# Altium project TL3572-EVM-A1.1-000-SCH-202609041404.PrjPcb (part 4 of 6)

## Sheet P13_ETH1 RGMII.SchDoc
size 420 x 297 mm
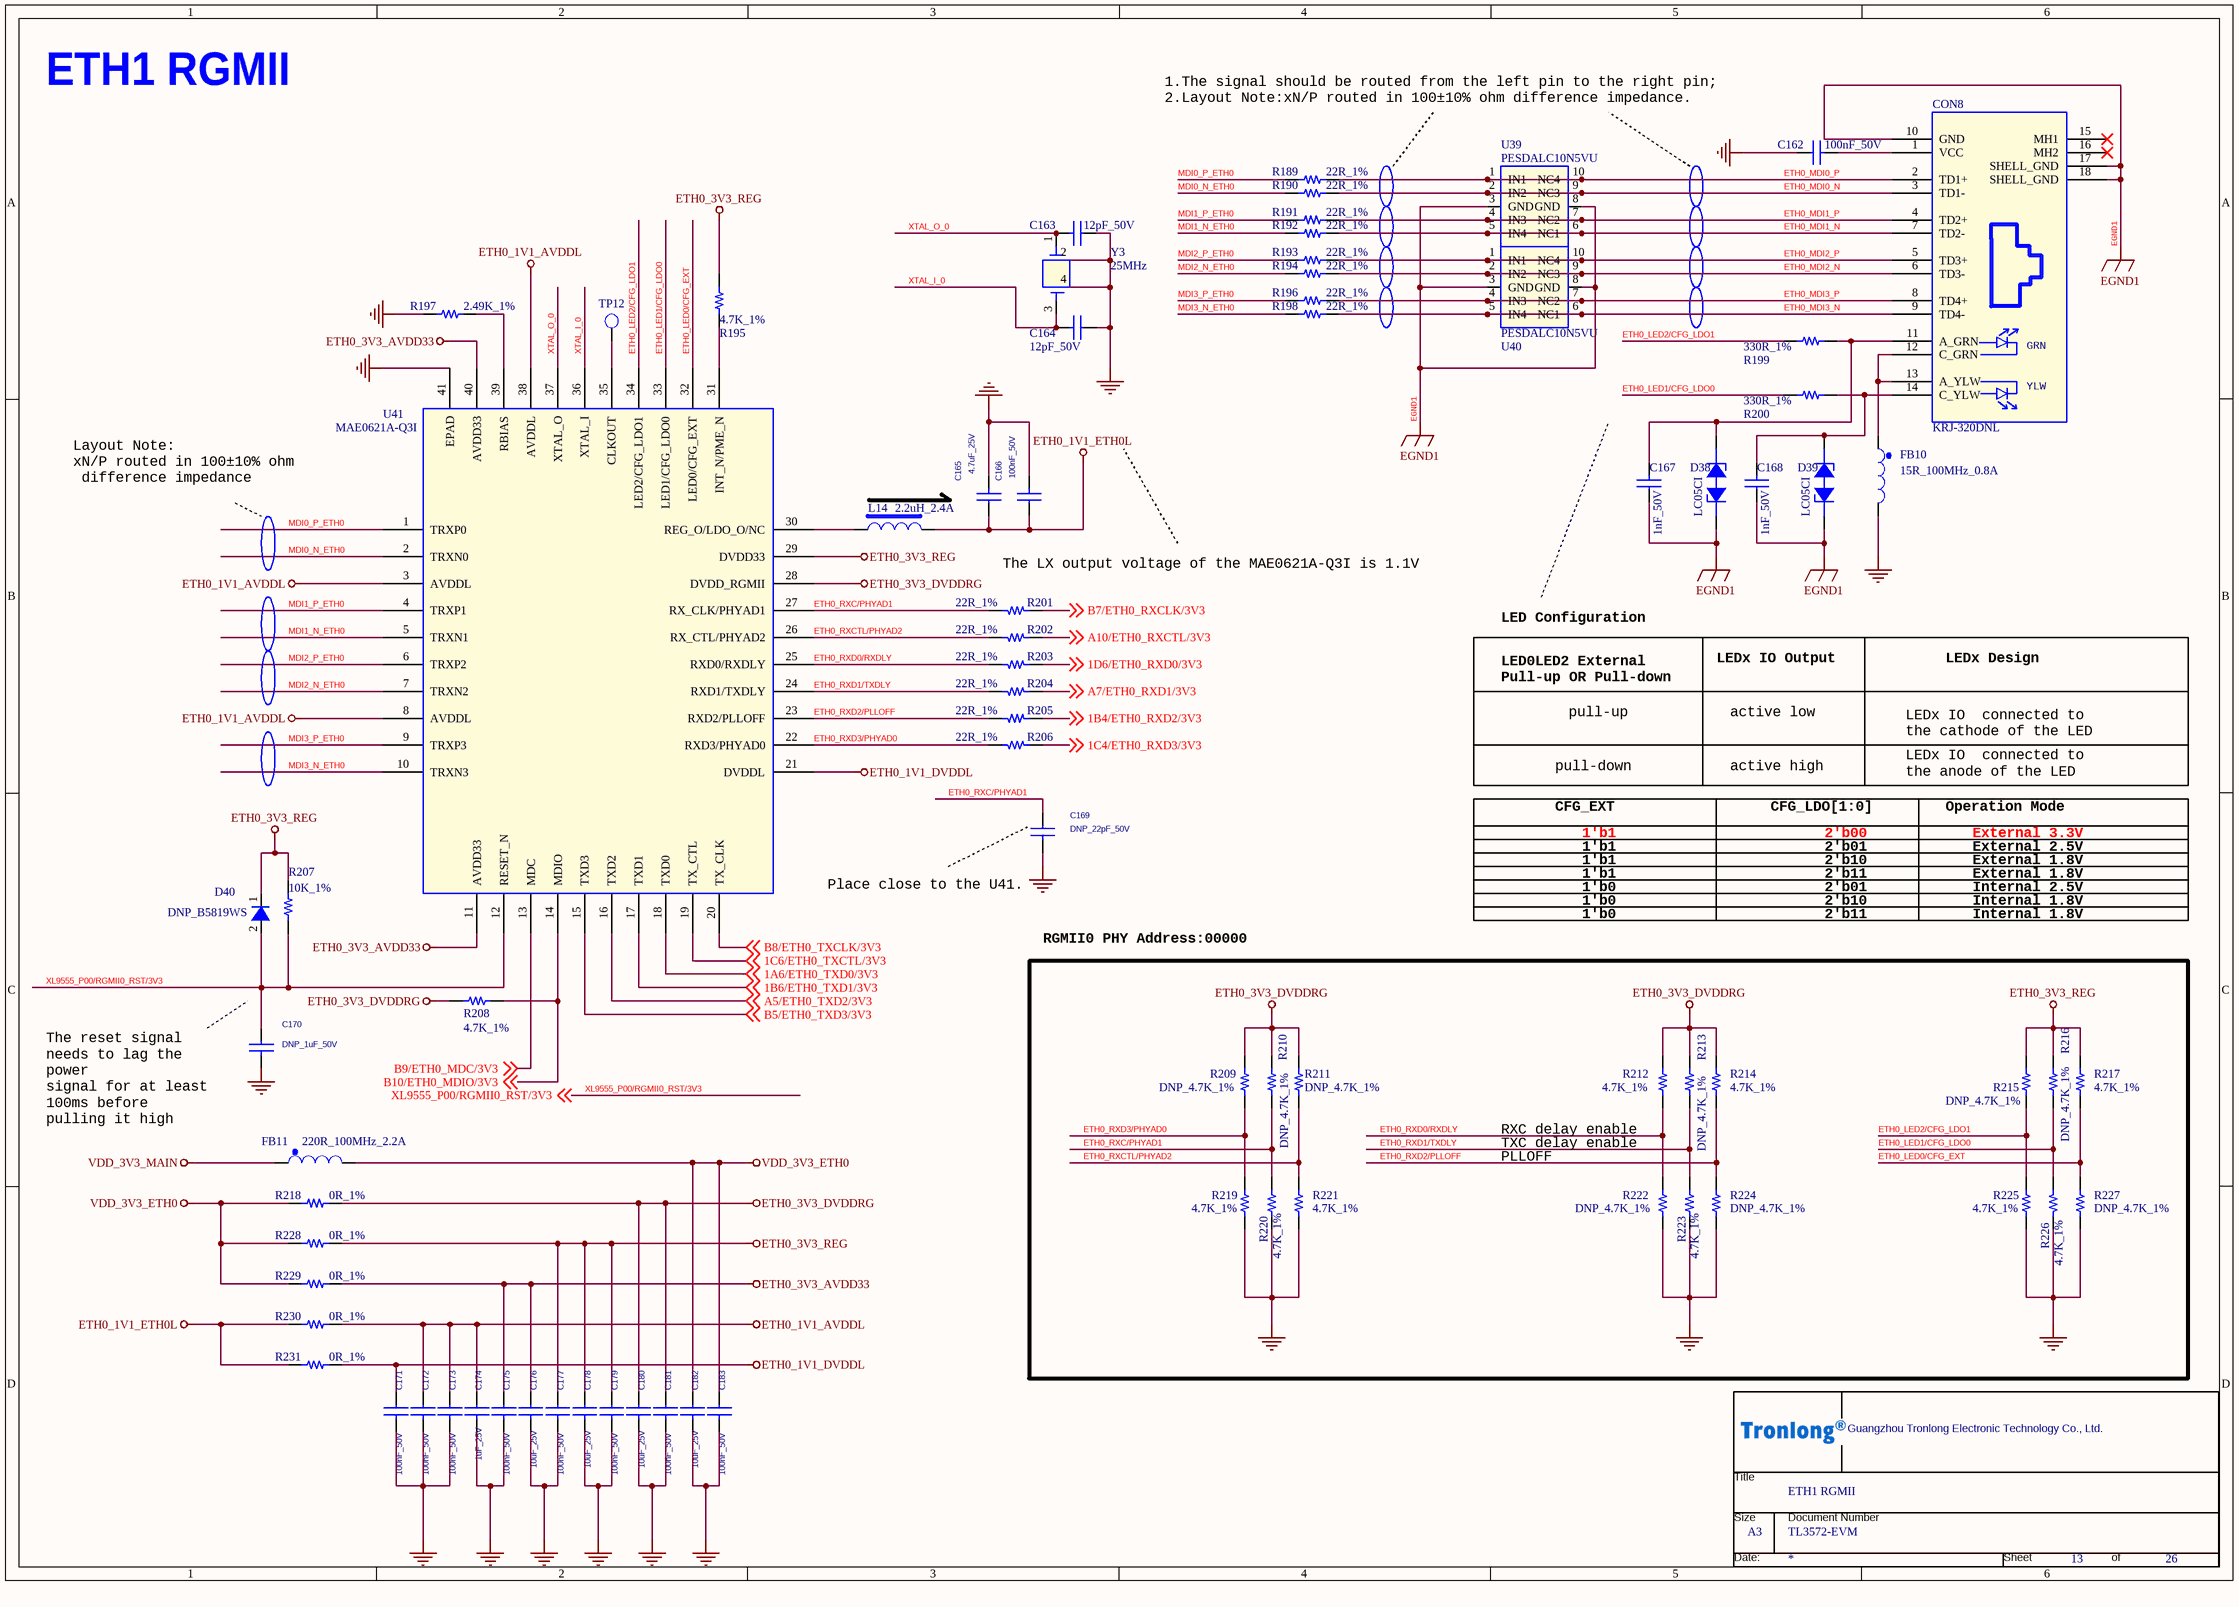
[diagram p9: P13_ETH1 RGMII.SchDoc]

### Parts
(Parts that share a designator on the sheet are numbered #1, #2 ... from top to bottom, then left to right.)
*#5  Doc: TL3572-EVM  Title: ETH1 RGMII  OrgName: Guangzhou Tronlong Electronic Technology Co., Ltd.  Page Size: A3  Page Number: 13  Page Count: 26  (hidden comment: Tronlong_TITTLE_20211115)  (graphical)
C162  100nF_50V  [C0402]
C163  12pF_50V  [C0402]
C164  12pF_50V  [C0402]
C165  4.7uF_25V  [C0603]
C166  100nF_50V  [C0402]
C167  1nF_50V  [C0402]
C168  1nF_50V  [C0402]
C169  DNP_22pF_50V  [C0402]
C170  DNP_1uF_50V  [C0603]
C171  100nF_50V  [C0402]
C172  100nF_50V  [C0402]
C173  100nF_50V  [C0402]
C174  1uF_25V  [C0402]
C175  100nF_50V  [C0402]
C176  10uF_25V  [C0603]
C177  100nF_50V  [C0402]
C178  10uF_25V  [C0603]
C179  100nF_50V  [C0402]
C180  10uF_25V  [C0603]
C181  100nF_50V  [C0402]
C182  10uF_25V  [C0603]
C183  100nF_50V  [C0402]
CON8  KRJ-320DNL  [KRJ-320DNL_14P]
D38  LC05CI  [SOD323]
D39  LC05CI  [SOD323]
D40  DNP_B5819WS  [SOD-323]
FB10  15R_100MHz_0.8A  [L0603]
FB11  220R_100MHz_2.2A  [L0603]
L14  2.2uH_2.4A  [SMD-L2520M-2P]
R189  22R_1%  [R0402]
R190  22R_1%  [R0402]
R191  22R_1%  [R0402]
R192  22R_1%  [R0402]
R193  22R_1%  [R0402]
R194  22R_1%  [R0402]
R195  4.7K_1%  [R0402]
R196  22R_1%  [R0402]
R197  2.49K_1%  [R0603]
R198  22R_1%  [R0402]
R199  330R_1%  [R0402]
R200  330R_1%  [R0402]
R201  22R_1%  [R0402]
R202  22R_1%  [R0402]
R203  22R_1%  [R0402]
R204  22R_1%  [R0402]
R205  22R_1%  [R0402]
R206  22R_1%  [R0402]
R207  10K_1%  [R0402]
R208  4.7K_1%  [R0402]
R209  DNP_4.7K_1%  [R0402]
R210  DNP_4.7K_1%  [R0402]
R211  DNP_4.7K_1%  [R0402]
R212  4.7K_1%  [R0402]
R213  DNP_4.7K_1%  [R0402]
R214  4.7K_1%  [R0402]
R215  DNP_4.7K_1%  [R0402]
R216  DNP_4.7K_1%  [R0402]
R217  4.7K_1%  [R0402]
R218  0R_1%  [R0603]
R219  4.7K_1%  [R0402]
R220  4.7K_1%  [R0402]
R221  4.7K_1%  [R0402]
R222  DNP_4.7K_1%  [R0402]
R223  4.7K_1%  [R0402]
R224  DNP_4.7K_1%  [R0402]
R225  4.7K_1%  [R0402]
R226  4.7K_1%  [R0402]
R227  DNP_4.7K_1%  [R0402]
R228  0R_1%  [R0603]
R229  0R_1%  [R0603]
R230  0R_1%  [R0603]
R231  0R_1%  [R0603]
TP12  SMT TP  [TP30]  (value not drawn)
U39  PESDALC10N5VU  [DFN-10-2510]
U40  PESDALC10N5VU  [DFN-10-2510]
U41  MAE0621A-Q3I  [QFN40_5x5]
Y3  25MHz  [SMD_3225]

### Nets
EGND1: C167.1 C168.1 CON8.10(GND) CON8.17(SHELL_GND) CON8.18(SHELL_GND) D38.1(ANODE1) D39.1(ANODE1) U39.3(GND) U39.8(GND) U40.3(GND) U40.8(GND)
ETH0_1V1_AVDDL: C172.1 C173.1 C174.1 R230.2 U41.3(AVDDL) U41.8(AVDDL) U41.38(AVDDL)
ETH0_1V1_DVDDL: C171.1 R231.2 U41.21(DVDDL)
ETH0_1V1_ETH0L: C165.1 C166.1 L14.2 R230.1 R231.1
ETH0_3V3_AVDD33: C175.1 C176.1 R229.2 U41.11(AVDD33) U41.40(AVDD33)
ETH0_3V3_DVDDRG: C180.1 C181.1 R208.1 R209.2 R210.2 R211.2 R212.2 R213.2 R214.2 R218.2 U41.28(DVDD_RGMII)
ETH0_3V3_REG: C177.1 C178.1 C179.1 D40.1(Cathode) R195.2 R207.2 R215.2 R216.2 R217.2 R228.2 U41.29(DVDD33)
GND: C162.1 C163.1 C164.1 C165.2 C166.2 C169.2 C170.2 C171.2 C172.2 C173.2 C174.2 C175.2 C176.2 C177.2 C178.2 C179.2 C180.2 C181.2 C182.2 C183.2 FB10.2 R197.2 R219.1 R220.1 R221.1 R222.1 R223.1 R224.1 R225.1 R226.1 R227.1 U41.41(EPAD) Y3.2 Y3.4
VDD_3V3_ETH0: C182.1 C183.1 FB11.2 R218.1 R228.1 R229.1
VDD_3V3_MAIN: FB11.1
1A6/ETH0_TXD0/3V3: U41.18(TXD0) ; off-sheet 1A6/ETH0_TXD0/3V3
1B4/ETH0_RXD2/3V3: R205.1 ; off-sheet 1B4/ETH0_RXD2/3V3
1B6/ETH0_TXD1/3V3: U41.17(TXD1) ; off-sheet 1B6/ETH0_TXD1/3V3
1C4/ETH0_RXD3/3V3: R206.1 ; off-sheet 1C4/ETH0_RXD3/3V3
1C6/ETH0_TXCTL/3V3: U41.19(TX_CTL) ; off-sheet 1C6/ETH0_TXCTL/3V3
1D6/ETH0_RXD0/3V3: R203.1 ; off-sheet 1D6/ETH0_RXD0/3V3
A5/ETH0_TXD2/3V3: U41.16(TXD2) ; off-sheet A5/ETH0_TXD2/3V3
A7/ETH0_RXD1/3V3: R204.1 ; off-sheet A7/ETH0_RXD1/3V3
A10/ETH0_RXCTL/3V3: R202.1 ; off-sheet A10/ETH0_RXCTL/3V3
B5/ETH0_TXD3/3V3: U41.15(TXD3) ; off-sheet B5/ETH0_TXD3/3V3
B7/ETH0_RXCLK/3V3: R201.1 ; off-sheet B7/ETH0_RXCLK/3V3
B8/ETH0_TXCLK/3V3: U41.20(TX_CLK) ; off-sheet B8/ETH0_TXCLK/3V3
B9/ETH0_MDC/3V3: U41.13(MDC) ; off-sheet B9/ETH0_MDC/3V3
B10/ETH0_MDIO/3V3: R208.2 U41.14(MDIO) ; off-sheet B10/ETH0_MDIO/3V3
ETH0_LED0/CFG_EXT: R217.1 R227.2 U41.32(LED0/CFG_EXT)
ETH0_LED1/CFG_LDO0: R200.1 R216.1 R226.2 U41.33(LED1/CFG_LDO0)
ETH0_LED2/CFG_LDO1: R199.1 R215.1 R225.2 U41.34(LED2/CFG_LDO1)
ETH0_MDI0_N: CON8.3(TD1-) R190.2 U39.2(IN2) U39.9(NC3)
ETH0_MDI0_P: CON8.2(TD1+) R189.2 U39.1(IN1) U39.10(NC4)
ETH0_MDI1_N: CON8.7(TD2-) R192.2 U39.5(IN4) U39.6(NC1)
ETH0_MDI1_P: CON8.4(TD2+) R191.2 U39.4(IN3) U39.7(NC2)
ETH0_MDI2_N: CON8.6(TD3-) R194.2 U40.2(IN2) U40.9(NC3)
ETH0_MDI2_P: CON8.5(TD3+) R193.2 U40.1(IN1) U40.10(NC4)
ETH0_MDI3_N: CON8.9(TD4-) R198.2 U40.5(IN4) U40.6(NC1)
ETH0_MDI3_P: CON8.8(TD4+) R196.2 U40.4(IN3) U40.7(NC2)
ETH0_RXC/PHYAD1: C169.1 R201.2 R210.1 R220.2 U41.27(RX_CLK/PHYAD1)
ETH0_RXCTL/PHYAD2: R202.2 R211.1 R221.2 U41.26(RX_CTL/PHYAD2)
ETH0_RXD0/RXDLY: R203.2 R212.1 R222.2 U41.25(RXD0/RXDLY)
ETH0_RXD1/TXDLY: R204.2 R213.1 R223.2 U41.24(RXD1/TXDLY)
ETH0_RXD2/PLLOFF: R205.2 R214.1 R224.2 U41.23(RXD2/PLLOFF)
ETH0_RXD3/PHYAD0: R206.2 R209.1 R219.2 U41.22(RXD3/PHYAD0)
MDI0_N_ETH0: R190.1 U41.2(TRXN0)
MDI0_P_ETH0: R189.1 U41.1(TRXP0)
MDI1_N_ETH0: R192.1 U41.5(TRXN1)
MDI1_P_ETH0: R191.1 U41.4(TRXP1)
MDI2_N_ETH0: R194.1 U41.7(TRXN2)
MDI2_P_ETH0: R193.1 U41.6(TRXP2)
MDI3_N_ETH0: R198.1 U41.10(TRXN3)
MDI3_P_ETH0: R196.1 U41.9(TRXP3)
XL9555_P00/RGMII0_RST/3V3: C170.1 D40.2(Anode) R207.1 U41.12(RESET_N) ; off-sheet XL9555_P00/RGMII0_RST/3V3
XTAL_I_0: C164.2 U41.36(XTAL_I) Y3.3
XTAL_O_0: C163.2 U41.37(XTAL_O) Y3.1
NetC162_2: C162.2 CON8.1(VCC)
NetC167_2: C167.2 CON8.11(A_GRN) D38.2(CATHODE2) R199.2
NetC168_2: C168.2 CON8.14(C_YLW) D39.2(CATHODE2) R200.2
NetCON8_12: CON8.12(C_GRN) CON8.13(A_YLW) FB10.1
NetL14_1: L14.1 U41.30(REG_O/LDO_O/NC)
NetR195_1: R195.1 U41.31(INT_N/PME_N)
NetR197_1: R197.1 U41.39(RBIAS)
NetTP12_1: TP12.1(TP) U41.35(CLKOUT)

Not connected (* = marked no-connect by the designer): CON8 15(MH1)* 16(MH2)*

### Notes on the sheet
- ETH1 RGMII
- 1.The signal should be routed from the left pin to the right pin;
  2.Layout Note:xN/P routed in 100±10% ohm difference impedance.
- Layout Note:
  xN/P routed in 100±10% ohm
  difference impedance
- The LX output voltage of the MAE0621A-Q3I is 1.1V
- LED Configuration
- LEDx IO Output
- LEDx Design
- LED0LED2 External
  Pull-up OR Pull-down
- pull-up
- active low
- LEDx IO  connected to
  the cathode of the LED
- pull-down
- active high
- LEDx IO  connected to
  the anode of the LED
- CFG_EXT
- 1'b1
- CFG_LDO[1:0]
- 2'b00
- 2'b01
- 2'b10
- Operation Mode
- External 3.3V
- External 2.5V
- External 1.8V
- Place close to the U41.
- 1'b0
- 2'b11
- Internal 2.5V
- Internal 1.8V
- RGMII0 PHY Address:00000
- (near C170) The reset signal
  needs to lag the
  power
  signal for at least
  100ms before
  pulling it high
- RXC delay enable
- TXC delay enable
- PLLOFF
- (in symbol KRJ-320DNL_0) GRN; YLW
- (in symbol Tronlong_TITTLE_20211115) Title; Size; Document Number; Date:; Sheet; of

### Library data of the parts
*#5 = Tronlong_TITTLE_20211115: RevCode: A?; Page Create Date: March  8, 1995; Page Modify Date: *
C162 = CAP NP_Dup2: 贴片陶瓷电容,100nF,10%,50V,X7R; Manufacturer Character: 中国大陆; Manufacturer PartNumber: 0402B104K500NT; Manufacturer: 广东风华高新科技股份有限公司（FH）; ERP Number: 005.0001.0001.00681; Operation Temperature（℃）: -55~+125(Ta); As-Welded: /; Eco-Label: ROHS; PCB Footprint: C0402; Part Status: 试用
C163 = CAP NP_Dup2: 贴片陶瓷电容,12pF,5%,50V,COG; Manufacturer Character: 中国大陆; Manufacturer PartNumber: 0402CG120J500NT; Manufacturer: 广东风华高新科技股份有限公司（FH）; ERP Number: 005.0001.0001.00612; As-Welded: /; Operation Temperature（℃）: -55~+125(Ta); Eco-Label: ROHS; PCB Footprint: C0402; Part Status: 试用
C164 = CAP NP_Dup2: 贴片陶瓷电容,12pF,5%,50V,COG; Manufacturer Character: 中国大陆; Manufacturer: 广东风华高新科技股份有限公司（FH）; Manufacturer PartNumber: 0402CG120J500NT; ERP Number: 005.0001.0001.00612; As-Welded: /; Operation Temperature（℃）: -55~+125(Ta); Eco-Label: ROHS; PCB Footprint: C0402; Part Status: 试用
C165 = CAP NP_Dup2: 贴片陶瓷电容,4.7uF,10%,25V,X5R; Manufacturer PartNumber: 0603X475K250NT; Manufacturer: 广东风华高新科技股份有限公司（FH）; Manufacturer Character: 中国大陆; Eco-Label: ROHS; As-Welded: /; Operation Temperature（℃）: -55~+85(Ta); ERP Number: 005.0001.0001.00566; PCB Footprint: C0603; Part Status: 优选
C166 = CAP NP_Dup2: 贴片陶瓷电容,100nF,10%,50V,X7R; Manufacturer Character: 中国大陆; Manufacturer: 广东风华高新科技股份有限公司（FH）; Manufacturer PartNumber: 0402B104K500NT; ERP Number: 005.0001.0001.00681; Operation Temperature（℃）: -55~+125(Ta); As-Welded: /; Eco-Label: ROHS; PCB Footprint: C0402; Part Status: 试用
C167 C168 = CAP NP_1: 贴片陶瓷电容,1nF,10%,50V,X7R; Manufacturer: 广东风华高新科技股份有限公司（FH）; Manufacturer PN: GRM033R61E102KA01; Manufacturer Character: 中国大陆; Manufacturer PartNumber: 0402B102K500NT; Eco-Label: ROHS; ERP Number: 005.0001.0001.00523; RK PN: 902003109; Priority: A; Operation Temperature（℃）: -55~+125(Ta); As-Welded: /; Part Status: 优选; Part Type: 一般用片状陶瓷电容; Tolerance: ±10%; Created by: JJJ
C169 = CAP NP_Dup2: 贴片陶瓷电容,22pF,5%,50V,COG; Manufacturer Character: 中国大陆; Manufacturer PartNumber: 0402CG220J500NT; Manufacturer: 广东风华高新科技股份有限公司（FH）; ERP Number: 005.0001.0001.00543; Operation Temperature（℃）: -55~+125(Ta); As-Welded: DNP; Eco-Label: EXEMPTION; PCB Footprint: C0402; Part Status: 优选
C170 = CAP NP_Dup2: 贴片陶瓷电容,1uF,10%,50V,X5R; Manufacturer Character: 中国大陆; Manufacturer PartNumber: 0603X105K500NT; Manufacturer: 广东风华高新科技股份有限公司（FH）; ERP Number: 005.0001.0001.00672; As-Welded: DNP; Operation Temperature（℃）: -55~+85(Ta); Eco-Label: ROHS; PCB Footprint: C0603; Part Status: 试用
C171 C173 C175 C177 C181 C183 = CAP NP_Dup2: 贴片陶瓷电容,100nF,10%,50V,X7R; Manufacturer: 广东风华高新科技股份有限公司（FH）; Manufacturer PartNumber: 0402B104K500NT; Manufacturer Character: 中国大陆; Eco-Label: ROHS; As-Welded: /; Operation Temperature（℃）: -55~+125(Ta); ERP Number: 005.0001.0001.00681; PCB Footprint: C0402; Part Status: 试用
C172 = CAP NP_Dup2: 贴片陶瓷电容,100nF,10%,50V,X7R; Manufacturer Character: 中国大陆; Manufacturer: 广东风华高新科技股份有限公司（FH）; Manufacturer PartNumber: 0402B104K500NT; Eco-Label: ROHS; As-Welded: /; Operation Temperature（℃）: -55~+125(Ta); ERP Number: 005.0001.0001.00681; PCB Footprint: C0402; Part Status: 试用
C174 = CAP NP_Dup2: 贴片陶瓷电容,1uF,10%,25V,X5R; Manufacturer: 广东风华高新科技股份有限公司（FH）; Manufacturer PartNumber: 0402X105K250NT; Manufacturer Character: 中国大陆; Eco-Label: ROHS; As-Welded: /; Operation Temperature（℃）: -55~+85(Ta); ERP Number: 005.0001.0001.00640; PCB Footprint: C0402; Part Status: 试用
C176 = CAP NP_Dup2: 贴片陶瓷电容,10uF,20%,25V,X5R; Manufacturer Character: 中国大陆; Manufacturer: 广东风华高新科技股份有限公司（FH）; Manufacturer PartNumber: 0603X106M250NT; Eco-Label: ROHS; Operation Temperature（℃）: -55~+85(Ta); As-Welded: /; ERP Number: 005.0001.0001.00527; PCB Footprint: C0603; Part Status: 优选
C178 = CAP NP_Dup2: 贴片陶瓷电容,10uF,20%,25V,X5R; Manufacturer Character: 中国大陆; Manufacturer PartNumber: 0603X106M250NT; Manufacturer: 广东风华高新科技股份有限公司（FH）; Eco-Label: ROHS; Operation Temperature（℃）: -55~+85(Ta); As-Welded: /; ERP Number: 005.0001.0001.00527; PCB Footprint: C0603; Part Status: 优选
C179 = CAP NP_Dup2: 贴片陶瓷电容,100nF,10%,50V,X7R; Manufacturer PartNumber: 0402B104K500NT; Manufacturer: 广东风华高新科技股份有限公司（FH）; Manufacturer Character: 中国大陆; Eco-Label: ROHS; As-Welded: /; Operation Temperature（℃）: -55~+125(Ta); ERP Number: 005.0001.0001.00681; PCB Footprint: C0402; Part Status: 试用
C180 = CAP NP_Dup2: 贴片陶瓷电容,10uF,20%,25V,X5R; Manufacturer: 广东风华高新科技股份有限公司（FH）; Manufacturer PartNumber: 0603X106M250NT; Manufacturer Character: 中国大陆; Eco-Label: ROHS; As-Welded: /; Operation Temperature（℃）: -55~+85(Ta); ERP Number: 005.0001.0001.00527; PCB Footprint: C0603; Part Status: 优选
C182 = CAP NP_Dup2: 贴片陶瓷电容,10uF,20%,25V,X5R; Manufacturer: 广东风华高新科技股份有限公司（FH）; Manufacturer PartNumber: 0603X106M250NT; Manufacturer Character: 中国大陆; ERP Number: 005.0001.0001.00527; As-Welded: /; Operation Temperature（℃）: -55~+85(Ta); Eco-Label: ROHS; PCB Footprint: C0603; Part Status: 优选
CON8 = KRJ-320DNL_0: RJ45连接器,14P,2.54mm间距,单层母座,90度,插件; Manufacturer Character: 中国大陆; Manufacturer: 东莞市科优达电子科技有限公司（DGKYD）; As-Welded: /; Operation Temperature（℃）: -40~+85(Ta); ERP Number: 005.0001.0003.00310; Eco-Label: ROHS; PCB Footprint: KRJ-320DNL_14P; Part Status: 优选; Temperature: -40~85℃; Manufacturer PartNumber: KRJ-320DNL
D38 = DIODE BREAKDOWN_2: TVS二极管,VRWM=5V,VBR=6V,一组,双向,30KV,30KV; Manufacturer Part Number: PESD3V3L1BA; Manufacturer: 上海雷卯电子科技有限公司（Leiditech）; Manufacturer Character: 中国大陆; As-Welded: /; Operation Temperature（℃）: -55~+125(Tj); room: KEY; ERP Number: 005.0001.0017.00060; Eco-Label: ROHS; PCB Footprint: SOD323; Part Status: 优选; Temperature: -55~155℃; Manufacturer PartNumber: LC05CI
D39 = DIODE BREAKDOWN_2: TVS二极管,VRWM=5V,VBR=6V,一组,双向,30KV,30KV; Manufacturer Character: 中国大陆; Manufacturer: 上海雷卯电子科技有限公司（Leiditech）; Manufacturer Part Number: PESD3V3L1BA; ERP Number: 005.0001.0017.00060; room: KEY; Operation Temperature（℃）: -55~+125(Tj); As-Welded: /; Eco-Label: ROHS; PCB Footprint: SOD323; Part Status: 优选; Manufacturer PartNumber: LC05CI; Temperature: -55~155℃
D40 = Diode200mA250V: 肖特基二极管,VR=40V,IF=1A,VF=0.6V@1A; TIIntPartnumber: 1E0013; MfrNum: MMSD103T1G; Mfr: On Semiconductor; Manufacturer Character: 中国大陆; Manufacturer: 江苏长晶科技股份有限公司（JSCJ）; DescriptiveText: Diode 200mA 250V 1.25V Forward Drop; PCB Footprint: smd123; Cost10K: 0.07; Cost100: 0.23; Vendor: Digikey; ERP Number: 005.0001.0010.00093; As-Welded: DNP; Operation Temperature（℃）: -55~+125(Tj); Eco-Label: ROHS; PartName: Diode200mA250V; Descriptive_Text: Diode 200mA 250V 1.25V Forward Drop; Temperature: -55~150; Manufacturer PartNumber: B5819WS; Part Status: 优选
FB10 = FB_0: 磁珠,100mΩ,0.8A,15R@100MHz; Manufacturer Character: 中国大陆; Manufacturer PartNumber: CBG160808U150T; Manufacturer: 广东风华高新科技股份有限公司(FH); Operation Temperature（℃）: -40~+85(Ta); As-Welded: /; ERP Number: 005.0001.0007.00013; Eco-Label: ROHS; PCB Footprint: L0603; Temperature: -40~85℃; Part Status: 试用
FB11 = FERRITE BEAD_Dup1: 磁珠,50mΩ,2.2A,220R@100MHz; Manufacturer Character: 中国大陆; Manufacturer PartNumber: UPZ1608U221-2R2TF; Manufacturer: 深圳顺络电子股份有限公司（Sunlord）; ERP Number: 005.0001.0007.00015; Operation Temperature（℃）: -55~+125(Ta); As-Welded: /; Eco-Label: ROHS; PCB Footprint: L0603; Part Status: 限选; Temperature: -55~125℃
L14 = INDUCTOR: 贴片功率电感,2.2uH,0.096Ω,Isat=2.9A,Irms=2.4A; Manufacturer: 深圳顺络电子股份有限公司(Sunlord); Manufacturer PartNumber: WPN252010U2R2MT; Manufacturer Character: 中国大陆; Parameter: L2520，奇力新一体成型电感，最大额定电流3A，内阻65毫欧，20%; Eco-Label: ROHS; Operation Temperature（℃）: -40~+125(Ta); As-Welded: /; ERP Number: 005.0001.0006.00132; PCB Footprint: SMD-L2520M-2P; Temperature: -40~125; Part Status: 试用
R189-R194 R196 R198 = Resistor_Dup1: 贴片电阻,22R,±1%,1/16W; Manufacturer PartNumber: RC-02K22R0FT; Manufacturer: 广东风华高新科技股份有限公司（FH）; Manufacturer PN: RC0402JR-0722RL; Manufacturer Character: 中国大陆; CLASS: DISCRETE; ERP Number: 005.0001.0002.01316; RK PN: 901001505; Priority: A; Tolerance: 5%; Operation Temperature（℃）: -55~+125(Ta); As-Welded: /; Eco-Label: ROHS; PCB Footprint: R0402; Part Status: 试用; Part Type: 通用厚膜电阻; Wattage: 1/16W; Created by: YTL
R195 = Resistor_Dup3: 贴片电阻,4.7K,±1%,1/16W; Manufacturer Character: 中国大陆; Manufacturer: 广东风华高新科技股份有限公司（FH）; Manufacturer PartNumber: RC-02K4701FT; CLASS: DISCRETE; Eco-Label: ROHS; Operation Temperature（℃）: -55~+125(Ta); As-Welded: /; ERP Number: 005.0001.0002.01359; PCB Footprint: R0402; Part Status: 试用
R197 = Resistor_Dup3: 贴片电阻,2.49K,±1%,1/10W; Manufacturer Character: 中国大陆; Manufacturer: 广东风华高新科技股份有限公司（FH）; Manufacturer PartNumber: RS-03K2491FT; CLASS: DISCRETE; ERP Number: 005.0001.0002.00969; Operation Temperature（℃）: -55~+155(Ta); As-Welded: /; Eco-Label: ROHS; PCB Footprint: R0603; Part Status: 优选
R199 R200 = Resistor_Dup3: RC0402FR-07330RL,0402WGF3300TCE; Manufacturer: 广州创龙; Manufacturer PartNumber: 330R,±1%,R0402,≥1/16W; CLASS: DISCRETE; Eco-Label: ROHS; As-Welded: /; Operation Temperature（℃）: -40~+85(Ta); ERP Number: 005.0001.0023.00144; PCB Footprint: R0402; Part Status: -; Manufacturer Character: -
R201 R204 = Resistor_Dup3: 贴片电阻,22R,±1%,1/16W; Manufacturer Character: 中国大陆; Manufacturer PartNumber: RC-02K22R0FT; Manufacturer: 广东风华高新科技股份有限公司（FH）; CLASS: DISCRETE; ERP Number: 005.0001.0002.01316; As-Welded: /; Operation Temperature（℃）: -55~+125(Ta); room: RS232; Eco-Label: ROHS; PCB Footprint: R0402; Part Status: 试用
R202 R203 R205 = Resistor_Dup3: 贴片电阻,22R,±1%,1/16W; Manufacturer: 广东风华高新科技股份有限公司（FH）; Manufacturer PartNumber: RC-02K22R0FT; Manufacturer Character: 中国大陆; CLASS: DISCRETE; ERP Number: 005.0001.0002.01316; As-Welded: /; Operation Temperature（℃）: -55~+125(Ta); room: RS232; Eco-Label: ROHS; PCB Footprint: R0402; Part Status: 试用
R206 = Resistor_Dup3: 贴片电阻,22R,±1%,1/16W; Manufacturer: 广东风华高新科技股份有限公司（FH）; Manufacturer PartNumber: RC-02K22R0FT; Manufacturer Character: 中国大陆; CLASS: DISCRETE; Eco-Label: ROHS; room: RS232; Operation Temperature（℃）: -55~+125(Ta); As-Welded: /; ERP Number: 005.0001.0002.01316; PCB Footprint: R0402; Part Status: 试用
R207 = Resistor_Dup3: 贴片电阻,10K,±1%,1/16W; Manufacturer Character: 中国大陆; Manufacturer: 广东风华高新科技股份有限公司（FH）; Manufacturer PartNumber: RC-02K1002FT; CLASS: DISCRETE; ERP Number: 005.0001.0002.01326; As-Welded: /; Operation Temperature（℃）: -55~+125(Ta); Eco-Label: ROHS; PCB Footprint: R0402; Part Status: 优选
R208 = Resistor_Dup3: 贴片电阻,4.7K,±1%,1/16W; Manufacturer PartNumber: RC-02K4701FT; Manufacturer: 广东风华高新科技股份有限公司（FH）; Manufacturer Character: 中国大陆; CLASS: DISCRETE; Eco-Label: ROHS; Operation Temperature（℃）: -55~+125(Ta); As-Welded: /; ERP Number: 005.0001.0002.01359; PCB Footprint: R0402; Part Status: 试用
R209 R216 = Resistor_Dup3: RC0402FR-074K7L,0402WGF4701TCE; Manufacturer PartNumber: 4.7K,±1%,R0402,≥1/16W; Manufacturer: 广州创龙; CLASS: DISCRETE; ERP Number: 005.0001.0023.00160; Operation Temperature（℃）: -40~+85(Ta); As-Welded: DNP; Eco-Label: ROHS; PCB Footprint: R0402; Part Status: -; Manufacturer Character: -
R210 = Resistor_Dup3: RC0402FR-074K7L,0402WGF4701TCE; Manufacturer: 广州创龙; Manufacturer PartNumber: 4.7K,±1%,R0402,≥1/16W; CLASS: DISCRETE; ERP Number: 005.0001.0023.00160; Operation Temperature（℃）: -40~+85(Ta); As-Welded: DNP; Eco-Label: ROHS; PCB Footprint: R0402; Manufacturer Character: -; Part Status: -
R211 R222 = Resistor_Dup3: RC0402FR-074K7L,0402WGF4701TCE; Manufacturer PartNumber: 4.7K,±1%,R0402,≥1/16W; Manufacturer: 广州创龙; CLASS: DISCRETE; Eco-Label: ROHS; As-Welded: DNP; Operation Temperature（℃）: -40~+85(Ta); ERP Number: 005.0001.0023.00160; PCB Footprint: R0402; Manufacturer Character: -; Part Status: -
R212 = Resistor_Dup3: 贴片电阻,4.7K,±1%,1/16W; Manufacturer: 广东风华高新科技股份有限公司（FH）; Manufacturer PartNumber: RC-02K4701FT; Manufacturer Character: 中国大陆; CLASS: DISCRETE; Eco-Label: ROHS; Operation Temperature（℃）: -55~+125(Ta); As-Welded: /; ERP Number: 005.0001.0002.01359; PCB Footprint: R0402; Part Status: 试用
R213 R215 R227 = Resistor_Dup3: RC0402FR-074K7L,0402WGF4701TCE; Manufacturer: 广州创龙; Manufacturer PartNumber: 4.7K,±1%,R0402,≥1/16W; CLASS: DISCRETE; Eco-Label: ROHS; As-Welded: DNP; Operation Temperature（℃）: -40~+85(Ta); ERP Number: 005.0001.0023.00160; PCB Footprint: R0402; Manufacturer Character: -; Part Status: -
R214 R217 = Resistor_Dup3: 贴片电阻,4.7K,±1%,1/16W; Manufacturer PartNumber: RC-02K4701FT; Manufacturer: 广东风华高新科技股份有限公司（FH）; Manufacturer Character: 中国大陆; CLASS: DISCRETE; ERP Number: 005.0001.0002.01359; Operation Temperature（℃）: -55~+125(Ta); As-Welded: /; Eco-Label: ROHS; PCB Footprint: R0402; Part Status: 试用
R218 R228 R229 R231 = Resistor_Dup3: 贴片电阻,0R,±1%,1/10W; Manufacturer Character: 中国大陆; Manufacturer PartNumber: RS-03000FT; Manufacturer: 广东风华高新科技股份有限公司（FH）; CLASS: DISCRETE; ERP Number: 005.0001.0002.00956; Operation Temperature（℃）: -55~+155(Ta); room: RS232; As-Welded: /; Eco-Label: ROHS; PCB Footprint: R0603; Part Status: 优选
R219 R220 = Resistor_Dup3: 贴片电阻,4.7K,±1%,1/16W; Manufacturer Character: 中国大陆; Manufacturer: 广东风华高新科技股份有限公司（FH）; Manufacturer PartNumber: RC-02K4701FT; CLASS: DISCRETE; ERP Number: 005.0001.0002.01359; Operation Temperature（℃）: -55~+125(Ta); As-Welded: /; Eco-Label: ROHS; PCB Footprint: R0402; Part Status: 试用
R221 = Resistor_Dup3: 贴片电阻,4.7K,±1%,1/16W; Manufacturer Character: 中国大陆; Manufacturer: 广东风华高新科技股份有限公司（FH）; Manufacturer PartNumber: RC-02K4701FT; CLASS: DISCRETE; Eco-Label: ROHS; As-Welded: /; Operation Temperature（℃）: -55~+125(Ta); ERP Number: 005.0001.0002.01359; PCB Footprint: R0402; Part Status: 试用
R223 = Resistor_Dup3: 贴片电阻,4.7K,±1%,1/16W; Manufacturer: 广东风华高新科技股份有限公司（FH）; Manufacturer PartNumber: RC-02K4701FT; Manufacturer Character: 中国大陆; CLASS: DISCRETE; ERP Number: 005.0001.0002.01359; As-Welded: /; Operation Temperature（℃）: -55~+125(Ta); Eco-Label: ROHS; PCB Footprint: R0402; Part Status: 试用
R224 = Resistor_Dup3: RC0402FR-074K7L,0402WGF4701TCE; Manufacturer PartNumber: 4.7K,±1%,R0402,≥1/16W; Manufacturer: 广州创龙; CLASS: DISCRETE; ERP Number: 005.0001.0023.00160; As-Welded: DNP; Operation Temperature（℃）: -40~+85(Ta); Eco-Label: ROHS; PCB Footprint: R0402; Manufacturer Character: -; Part Status: -
R225 R226 = Resistor_Dup3: 贴片电阻,4.7K,±1%,1/16W; Manufacturer Character: 中国大陆; Manufacturer PartNumber: RC-02K4701FT; Manufacturer: 广东风华高新科技股份有限公司（FH）; CLASS: DISCRETE; Eco-Label: ROHS; Operation Temperature（℃）: -55~+125(Ta); As-Welded: /; ERP Number: 005.0001.0002.01359; PCB Footprint: R0402; Part Status: 试用
R230 = Resistor_Dup3: 贴片电阻,0R,±1%,1/10W; Manufacturer: 广东风华高新科技股份有限公司（FH）; Manufacturer PartNumber: RS-03000FT; Manufacturer Character: 中国大陆; CLASS: DISCRETE; Eco-Label: ROHS; As-Welded: /; room: RS232; Operation Temperature（℃）: -55~+155(Ta); ERP Number: 005.0001.0002.00956; PCB Footprint: R0603; Part Status: 优选
TP12 = T POINT R: /; Manufacturer Character: 中国大陆; CLASS: IC; As-Welded: DNP; PCB Footprint: TP30; Manufacturer: /; HEIGHT: 0.1MM; Operation Temperature（℃）: /; Manufacturer PartNumber: /
U39 = SU099PGTR: ESD二极管,VRWM=5V,VBR=6V,四组,单向,15KV,30KV; Manufacturer Character: 中国大陆; Manufacturer: 上海芯导电子科技股份有限公司（Prisemi）; ERP Number: 005.0001.0004.00739; Operation Temperature（℃）: -55~+150(Tj); As-Welded: /; Eco-Label: ROHS; Part Status: 优选; Manufacturer PartNumber: PESDALC10N5VU; Temperature: -55~150; PCB Footprint: DFN-10-2510
U40 = SU099PGTR: ESD二极管,VRWM=5V,VBR=6V,四组,单向,15KV,30KV; Manufacturer Character: 中国大陆; Manufacturer: 上海芯导电子科技股份有限公司（Prisemi）; Eco-Label: ROHS; As-Welded: /; Operation Temperature（℃）: -55~+150(Tj); ERP Number: 005.0001.0004.00739; PCB Footprint: DFN-10-2510; Temperature: -55~150; Manufacturer PartNumber: PESDALC10N5VU; Part Status: 优选
U41 = YT8531H-CA: 以太网收发器，RGMII/GMII/MII; Manufacturer Character: 中国大陆; Manufacturer: 联芸科技（杭州）股份有限公司; Eco-Label: ROHS; ERP Number: 005.0001.0004.01249; As-Welded: /; Operation Temperature（℃）: -40~+85(Ta); PCB Footprint: QFN40_5x5; Manufacturer PartNumber: MAE0621A-Q3I; Part Status: 优选
Y3 = CRYSTAL-4 PIN: 四脚无源晶振,25MHz,±10ppm,12pF,30Ω,±30ppm; Manufacturer Character: 中国大陆; Manufacturer PartNumber: S3B25.000F1210F30; Manufacturer: 深圳市星通时频电子有限公司（SCTF）; ERP Number: 005.0001.0005.00124; As-Welded: /; Operation Temperature（℃）: -40~+85(Ta); Eco-Label: ROHS; Temperature: -40~85; Part Status: 试用; PCB Footprint: SMD_3225

## Sheet P19_M.2 KEY M SSD_WI-FI_BT.SchDoc
size 420 x 297 mm
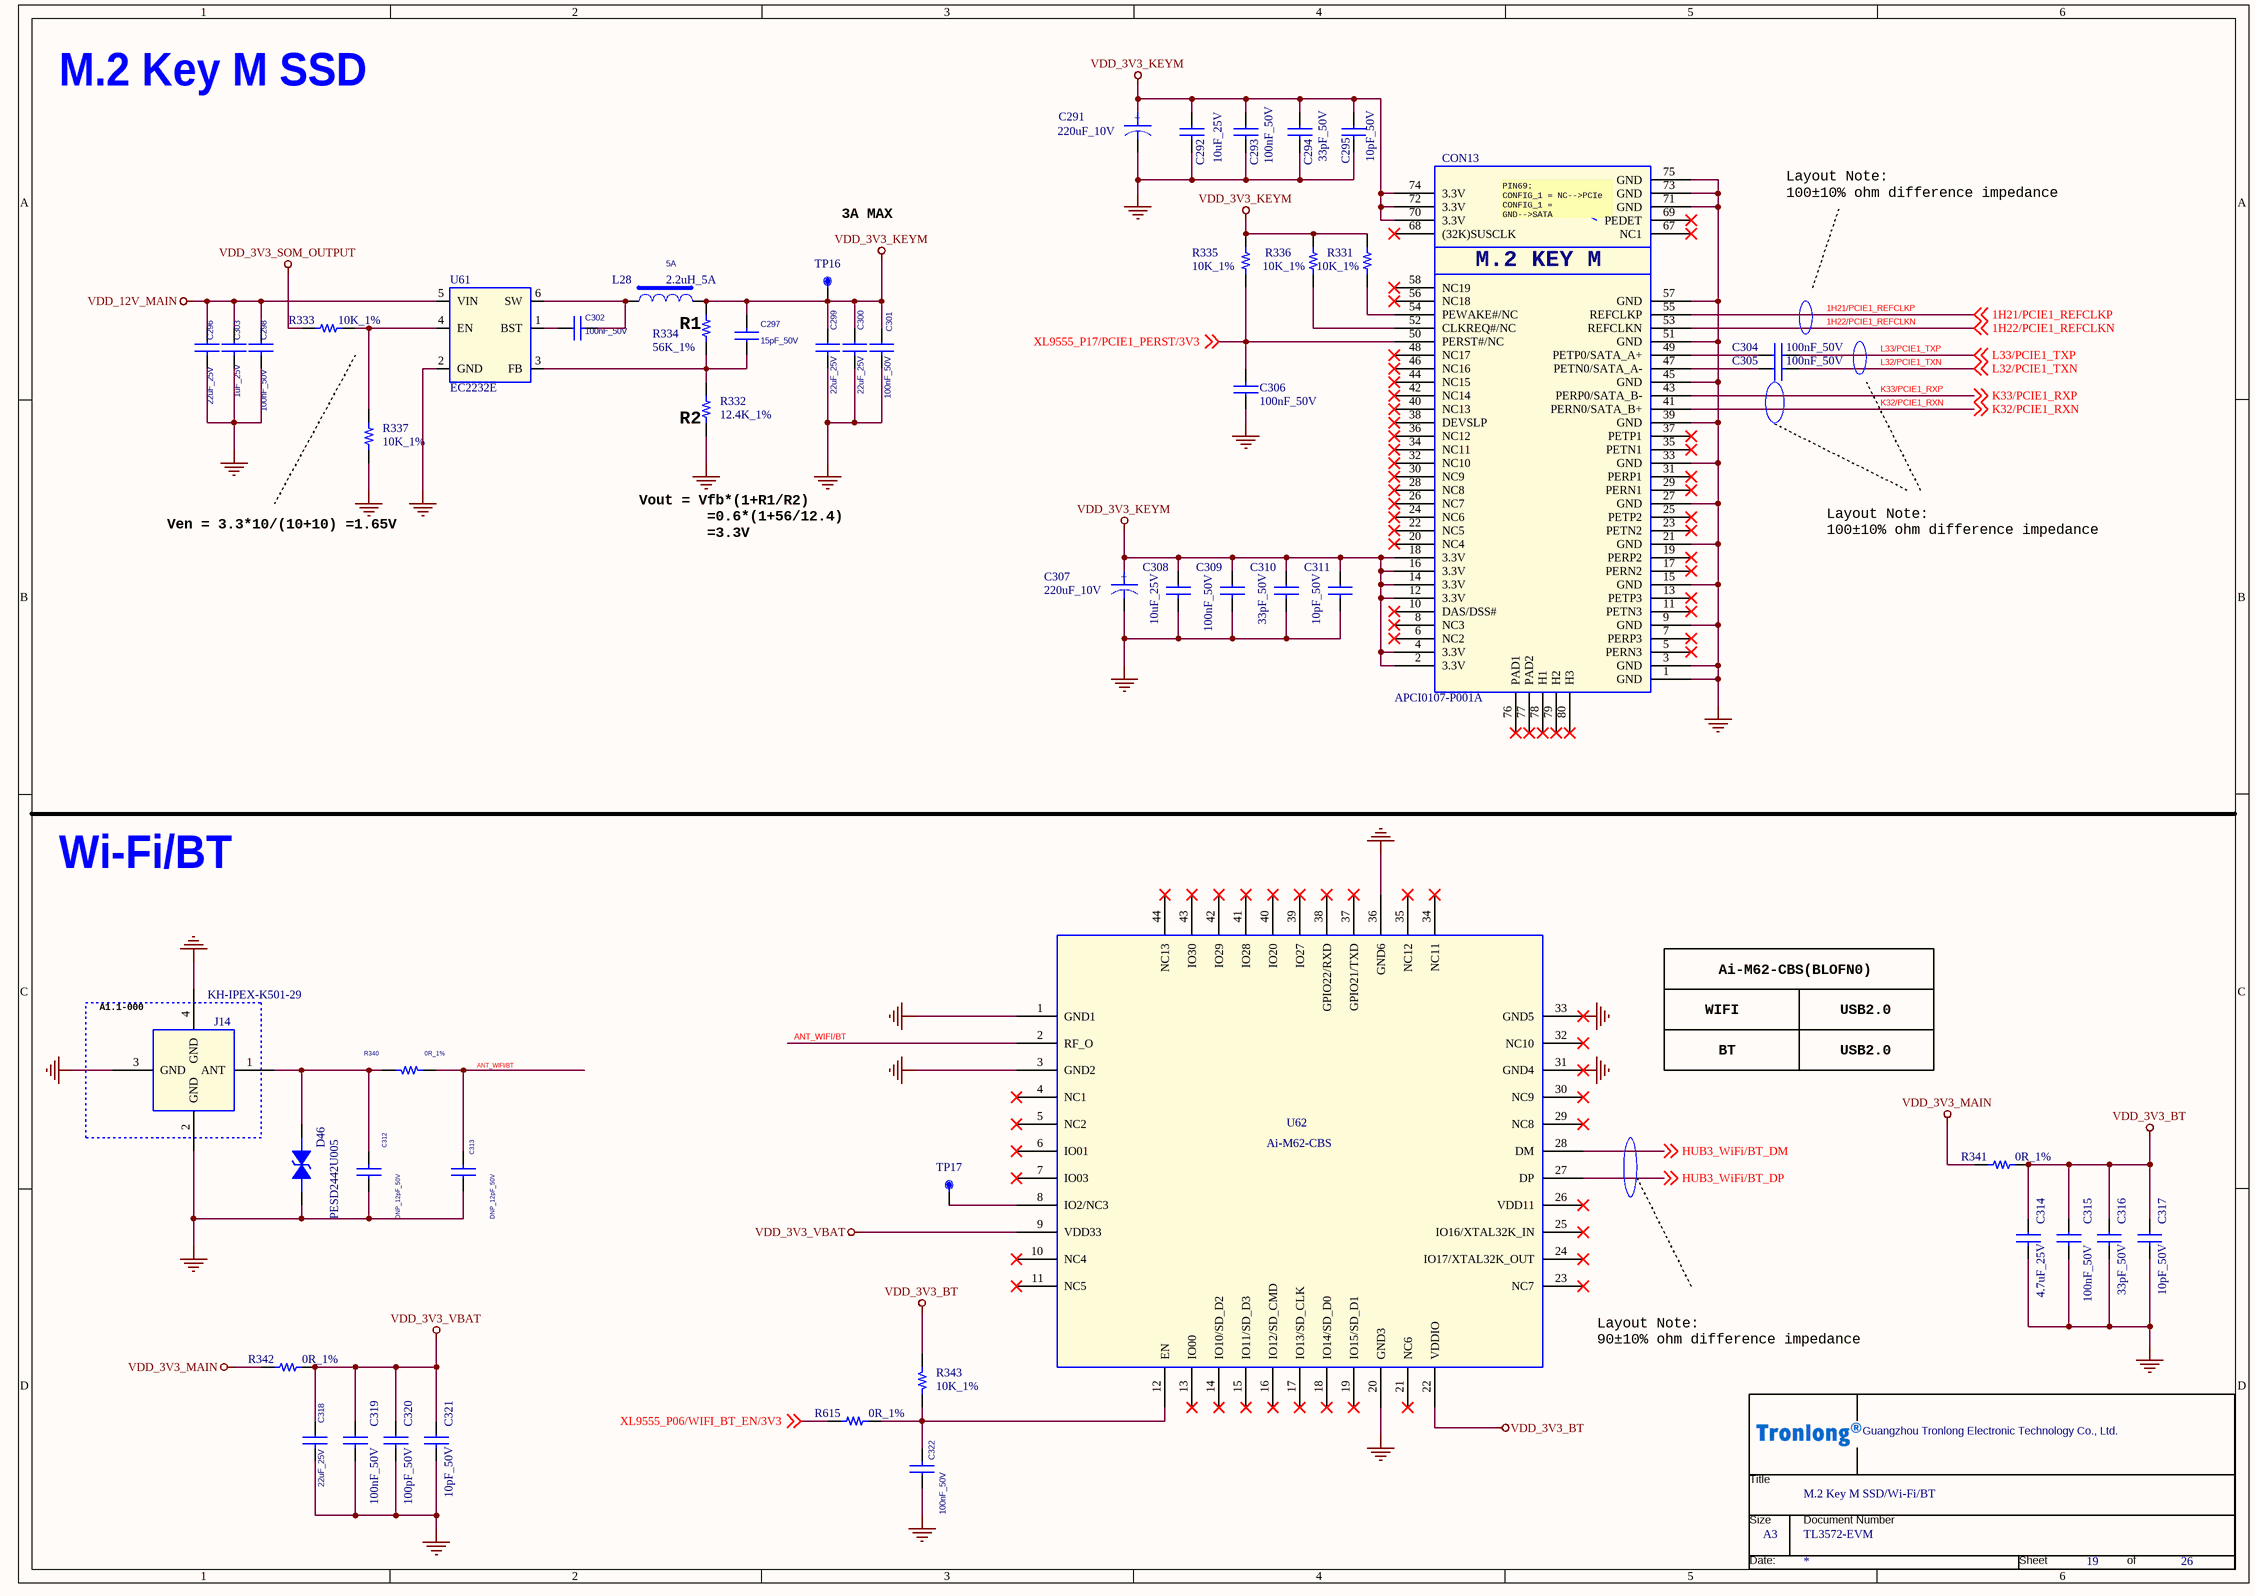
[diagram p10: P19_M.2 KEY M SSD_WI-FI_BT.SchDoc]

### Parts
(Parts that share a designator on the sheet are numbered #1, #2 ... from top to bottom, then left to right.)
*#6  Doc: TL3572-EVM  Title: M.2 Key M SSD/Wi-Fi/BT  OrgName: Guangzhou Tronlong Electronic Technology Co., Ltd.  Page Size: A3  Page Number: 19  Page Count: 26  (hidden comment: Tronlong_TITTLE_20211115)  (graphical)
C291  220uF_10V  [CAP-CASE-D]
C292  10uF_25V  [C0603]
C293  100nF_50V  [C0402]
C294  33pF_50V  [C0402]
C295  10pF_50V  [C0603]
C296  22uF_25V  [C0805]
C297  15pF_50V  [C0603]
C298  100nF_50V  [C0402]
C299  22uF_25V  [C0805]
C300  22uF_25V  [C0805]
C301  100nF_50V  [C0402]
C302  100nF_50V  [C0402]
C303  1uF_25V  [C0402]
C304  100nF_50V  [C0402]
C305  100nF_50V  [C0402]
C306  100nF_50V  [C0402]
C307  220uF_10V  [CAP-CASE-D]
C308  10uF_25V  [C0603]
C309  100nF_50V  [C0402]
C310  33pF_50V  [C0402]
C311  10pF_50V  [C0603]
C312  DNP_12pF_50V  [C0402]
C313  DNP_12pF_50V  [C0402]
C314  4.7uF_25V  [C0603]
C315  100nF_50V  [C0402]
C316  33pF_50V  [C0402]
C317  10pF_50V  [C0603]
C318  22uF_25V  [C0805]
C319  100nF_50V  [C0402]
C320  100pF_50V  [C0402]
C321  10pF_50V  [C0603]
C322  100nF_50V  [C0402]
CON13  APCI0107-P001A  [CON_SMD_APCI0113-P001A]
D46  PESD2442U005  [ESD_0402]
J14  KH-IPEX-K501-29  [IPEX1]
L28  2.2uH_5A  Current: 5A  [SMD-L4040M-2P]
R331  10K_1%  [R0402]
R332  12.4K_1%  [R0402]
R333  10K_1%  [R0402]
R334  56K_1%  [R0402]
R335  10K_1%  [R0402]
R336  10K_1%  [R0402]
R337  10K_1%  [R0402]
R340  0R_1%  [R0402]
R341  0R_1%  [R0603]
R342  0R_1%  [R0603]
R343  10K_1%  [R0402]
R615  0R_1%  [R0603]
TP16  SMT TP  [TP30]  (value not drawn)
TP17  SMT TP  [TP30]  (value not drawn)
U61  EC2232E  [SOT-23-6L]
U62  Ai-M62-CBS  [FCS950U]

### Blocks framed on the sheet
A1.1-000: J14

### Nets
GND: C291.2 C292.2 C293.2 C294.2 C295.2 C296.2 C298.2 C299.2 C300.2 C301.2 C303.2 C306.1 C307.2 C308.2 C309.2 C310.2 C311.2 C312.1 C313.1 C314.2 C315.2 C316.2 C317.2 C318.2 C319.2 C320.2 C321.2 C322.1 CON13.1(GND) CON13.3(GND) CON13.9(GND) CON13.15(GND) CON13.21(GND) CON13.27(GND) CON13.33(GND) CON13.39(GND) CON13.45(GND) CON13.51(GND) CON13.57(GND) CON13.71(GND) CON13.73(GND) CON13.75(GND) D46.1 J14.2(GND) J14.3(GND) J14.4(GND) R332.1 R337.1 U61.2(GND) U62.1(GND1) U62.3(GND2) U62.20(GND3) U62.31(GND4) U62.33(GND5) U62.36(GND6)
VDD_3V3_BT: C314.1 C315.1 C316.1 C317.1 R341.2 R343.2 U62.22(VDDIO)
VDD_3V3_KEYM: C291.1 C292.1 C293.1 C294.1 C295.1 C297.2 C299.1 C300.1 C301.1 C307.1 C308.1 C309.1 C310.1 C311.1 CON13.2(3.3V) CON13.4(3.3V) CON13.12(3.3V) CON13.14(3.3V) CON13.16(3.3V) CON13.18(3.3V) CON13.70(3.3V) CON13.72(3.3V) CON13.74(3.3V) L28.2 R331.1 R334.2 R335.1 R336.1 TP16.1
VDD_3V3_MAIN: R341.1 R342.1
VDD_3V3_SOM_OUTPUT: R333.2
VDD_3V3_VBAT: C318.1 C319.1 C320.1 C321.1 R342.2 U62.9(VDD33)
VDD_12V_MAIN: C296.1 C298.1 C303.1 U61.5(VIN)
1H21/PCIE1_REFCLKP: CON13.55(REFCLKP) ; off-sheet 1H21/PCIE1_REFCLKP
1H22/PCIE1_REFCLKN: CON13.53(REFCLKN) ; off-sheet 1H22/PCIE1_REFCLKN
ANT_WIFI/BT: C313.2 R340.1 U62.2(RF_O)
HUB3_WiFi/BT_DM: U62.28(DM) ; off-sheet HUB3_WiFi/BT_DM
HUB3_WiFi/BT_DP: U62.27(DP) ; off-sheet HUB3_WiFi/BT_DP
K32/PCIE1_RXN: CON13.41(PERN0/SATA_B+) ; off-sheet K32/PCIE1_RXN
K33/PCIE1_RXP: CON13.43(PERP0/SATA_B-) ; off-sheet K33/PCIE1_RXP
L32/PCIE1_TXN: C305.2 ; off-sheet L32/PCIE1_TXN
L33/PCIE1_TXP: C304.2 ; off-sheet L33/PCIE1_TXP
XL9555_P06/WIFI_BT_EN/3V3: R615.1 ; off-sheet XL9555_P06/WIFI_BT_EN/3V3
XL9555_P17/PCIE1_PERST/3V3: C306.2 CON13.50(PERST#/NC) R335.2 ; off-sheet XL9555_P17/PCIE1_PERST/3V3
NetC297_1: C297.1 R332.2 R334.1 U61.3(FB)
NetC302_1: C302.1 U61.1(BST)
NetC302_2: C302.2 L28.1 U61.6(SW)
NetC304_1: C304.1 CON13.49(PETP0/SATA_A+)
NetC305_1: C305.1 CON13.47(PETN0/SATA_A-)
NetC312_2: C312.2 D46.2 J14.1(ANT) R340.2
NetC322_2: C322.2 R343.1 R615.2 U62.12(EN)
NetCON13_52: CON13.52(CLKREQ#/NC) R336.2
NetCON13_54: CON13.54(PEWAKE#/NC) R331.2
NetR333_1: R333.1 R337.2 U61.4(EN)
NetTP17_1: TP17.1 U62.8(IO2/NC3)

Not connected (* = marked no-connect by the designer): CON13 5(PERN3)* 6(NC2)* 7(PERP3)* 8(NC3)* 10(DAS/DSS#)* 11(PETN3)* 13(PETP3)* 17(PERN2)* 19(PERP2)* 20(NC4)* 22(NC5)* 23(PETN2)* 24(NC6)* 25(PETP2)* 26(NC7)* 28(NC8)* 29(PERN1)* 30(NC9)* 31(PERP1)* 32(NC10)* 34(NC11)* 35(PETN1)* 36(NC12)* 37(PETP1)* 38(DEVSLP)* 40(NC13)* 42(NC14)* 44(NC15)* 46(NC16)* 48(NC17)* 56(NC18)* 58(NC19)* 67(NC1)* 68((32K)SUSCLK)* 69(PEDET)* 76(PAD1)* 77(PAD2)* 78(H1)* 79(H2)* 80(H3)*; U62 4(NC1)* 5(NC2)* 6(IO01)* 7(IO03)* 10(NC4)* 11(NC5)* 13(IO00)* 14(IO10/SD_D2)* 15(IO11/SD_D3)* 16(IO12/SD_CMD)* 17(IO13/SD_CLK)* 18(IO14/SD_D0)* 19(IO15/SD_D1)* 21(NC6)* 23(NC7)* 24(IO17/XTAL32K_OUT)* 25(IO16/XTAL32K_IN)* 26(VDD11)* 29(NC8)* 30(NC9)* 32(NC10)* 34(NC11)* 35(NC12)* 37(GPIO21/TXD)* 38(GPIO22/RXD)* 39(IO27)* 40(IO20)* 41(IO28)* 42(IO29)* 43(IO30)* 44(NC13)*

### Notes on the sheet
- M.2 Key M SSD
- Layout Note:
  100±10% ohm difference impedance
- 3A MAX
- R1
- (near R332) R2
- Ven = 3.3*10/(10+10) =1.65V
- Vout = Vfb*(1+R1/R2)
  =0.6*(1+56/12.4)
  =3.3V
- Wi-Fi/BT
- Ai-M62-CBS(BLOFN0)
- WIFI
- BT
- USB2.0
- Layout Note:
  90±10% ohm difference impedance
- (in symbol CAP POL_Dup1) +
- (in symbol M_2.2 KEY M) PIN69: / CONFIG_1 = NC-->PCIe / CONFIG_1 = / GND-->SATA; M.2 KEY M
- (in symbol Tronlong_TITTLE_20211115) Title; Size; Document Number; Date:; Sheet; of

### Library data of the parts
*#6 = Tronlong_TITTLE_20211115: RevCode: A?; Page Create Date: March  8, 1995; Page Modify Date: *
C291 = CAP POL_Dup1: D型钽电容,220uF,10%,10V; Manufacturer: 湖南湘怡中元科技有限公司（XIANGYEE）; Manufacturer PartNumber: CA45-D010K227T; Manufacturer Character: 中国大陆; Eco-Label: ROHS; ERP Number: 005.0001.0001.00571; Operation Temperature（℃）: -55~+125(Ta); As-Welded: /; PCB Footprint: CAP-CASE-D; Temperature: -55~125℃; Part Status: 优选
C292 = CAP NP_Dup2: 贴片陶瓷电容,10uF,20%,25V,X5R; Manufacturer Character: 中国大陆; Manufacturer PartNumber: 0603X106M250NT; Manufacturer: 广东风华高新科技股份有限公司（FH）; As-Welded: /; Operation Temperature（℃）: -55~+85(Ta); room: 6; ERP Number: 005.0001.0001.00527; Eco-Label: ROHS; PCB Footprint: C0603; Part Status: 优选; Temperature: -55~125℃
C293 C302 = CAP NP_Dup2: 贴片陶瓷电容,100nF,10%,50V,X7R; Manufacturer: 广东风华高新科技股份有限公司（FH）; Manufacturer PartNumber: 0402B104K500NT; Manufacturer Character: 中国大陆; As-Welded: /; Operation Temperature（℃）: -55~+125(Ta); ERP Number: 005.0001.0001.00681; Eco-Label: ROHS; PCB Footprint: C0402; Part Status: 试用; Temperature: -55~125℃
C294 = CAP NP_Dup2: 贴片陶瓷电容,33pF,5%,50V,COG; Manufacturer Character: 中国大陆; Manufacturer: 广东风华高新科技股份有限公司（FH）; Manufacturer PartNumber: 0402CG330J500NT; Eco-Label: ROHS; ERP Number: 005.0001.0001.00658; Operation Temperature（℃）: -55~+125(Ta); As-Welded: /; PCB Footprint: C0402; Temperature: -55~125℃; Part Status: 试用
C295 C317 = CAP NP_Dup2: CL10C100JB8NNNC,CC0603JRNPO9BN100,CC0603JRNP09BN100; Manufacturer: 广州创龙; Manufacturer PartNumber: 10pF,5%,C0603,50V,（X7R,X5R,COG,NPO或X7S）; Eco-Label: ROHS; ERP Number: 005.0001.0022.00118; Operation Temperature（℃）: -40~+85(Ta); As-Welded: /; PCB Footprint: C0603; Manufacturer Character: -; Temperature: -55~125℃; Part Status: -
C296 C299 C300 = CAP NP_Dup2: 贴片陶瓷电容,22uF,20%,25V,X5R; Manufacturer Character: 中国大陆; Manufacturer PartNumber: 0805X226M250NT; Manufacturer: 广东风华高新科技股份有限公司（FH）; Eco-Label: ROHS; ERP Number: 005.0001.0001.00524; Operation Temperature（℃）: -55~+85(Ta); As-Welded: /; PCB Footprint: C0805; Part Status: 优选; Temperature: -55~125℃
C297 = CAP NP_Dup2: CL10C150JB8NNNC,CC0603JRNPO9BN150; Manufacturer PartNumber: 15pF,5%,C0603,50V,（X7R,X5R,COG,NPO或X7S）; Manufacturer: 广州创龙; Eco-Label: ROHS; ERP Number: 005.0001.0022.00126; Operation Temperature（℃）: -40~+85(Ta); As-Welded: /; PCB Footprint: C0603; Part Status: -; Temperature: -55~125℃; Manufacturer Character: -
C298 C322 = CAP NP_Dup2: 贴片陶瓷电容,100nF,10%,50V,X7R; Manufacturer PartNumber: 0402B104K500NT; Manufacturer: 广东风华高新科技股份有限公司（FH）; Manufacturer Character: 中国大陆; Eco-Label: ROHS; ERP Number: 005.0001.0001.00681; Operation Temperature（℃）: -55~+125(Ta); As-Welded: /; PCB Footprint: C0402; Part Status: 试用; Temperature: -55~125℃
C301 C309 = CAP NP_Dup2: 贴片陶瓷电容,100nF,10%,50V,X7R; Manufacturer PartNumber: 0402B104K500NT; Manufacturer: 广东风华高新科技股份有限公司（FH）; Manufacturer Character: 中国大陆; As-Welded: /; Operation Temperature（℃）: -55~+125(Ta); ERP Number: 005.0001.0001.00681; Eco-Label: ROHS; PCB Footprint: C0402; Temperature: -55~125℃; Part Status: 试用
C303 = CAP NP_Dup2: 贴片陶瓷电容,1uF,10%,25V,X5R; Manufacturer Character: 中国大陆; Manufacturer: 广东风华高新科技股份有限公司（FH）; Manufacturer PartNumber: 0402X105K250NT; Eco-Label: ROHS; ERP Number: 005.0001.0001.00640; Operation Temperature（℃）: -55~+85(Ta); As-Welded: /; PCB Footprint: C0402; Part Status: 试用
C304 C305 = CAP NP_Dup2: 贴片陶瓷电容,100nF,10%,50V,X7R; Manufacturer PartNumber: 0402B104K500NT; Manufacturer Character: 中国大陆; Manufacturer: 广东风华高新科技股份有限公司（FH）; As-Welded: /; Operation Temperature（℃）: -55~+125(Ta); ERP Number: 005.0001.0001.00681; Eco-Label: ROHS; PCB Footprint: C0402; Voltage: 50V; Height: 0.55MM; Part Status: 试用
C306 = CAP NP_Dup2: 贴片陶瓷电容,100nF,10%,50V,X7R; Manufacturer Character: 中国大陆; Manufacturer PartNumber: 0402B104K500NT; Manufacturer: 广东风华高新科技股份有限公司（FH）; Eco-Label: ROHS; ERP Number: 005.0001.0001.00681; Operation Temperature（℃）: -55~+125(Ta); room: USB HUB; As-Welded: /; PCB Footprint: C0402; Part Status: 试用
C307 = CAP POL_Dup1: D型钽电容,220uF,10%,10V; Manufacturer PartNumber: CA45-D010K227T; Manufacturer: 湖南湘怡中元科技有限公司（XIANGYEE）; Manufacturer Character: 中国大陆; Eco-Label: ROHS; ERP Number: 005.0001.0001.00571; Operation Temperature（℃）: -55~+125(Ta); As-Welded: /; PCB Footprint: CAP-CASE-D; Temperature: -55~125℃; Part Status: 优选
C308 = CAP NP_Dup2: 贴片陶瓷电容,10uF,20%,25V,X5R; Manufacturer PartNumber: 0603X106M250NT; Manufacturer: 广东风华高新科技股份有限公司（FH）; Manufacturer Character: 中国大陆; As-Welded: /; room: 6; Operation Temperature（℃）: -55~+85(Ta); ERP Number: 005.0001.0001.00527; Eco-Label: ROHS; PCB Footprint: C0603; Part Status: 优选; Temperature: -55~125℃
C310 = CAP NP_Dup2: 贴片陶瓷电容,33pF,5%,50V,COG; Manufacturer Character: 中国大陆; Manufacturer PartNumber: 0402CG330J500NT; Manufacturer: 广东风华高新科技股份有限公司（FH）; Eco-Label: ROHS; ERP Number: 005.0001.0001.00658; Operation Temperature（℃）: -55~+125(Ta); As-Welded: /; PCB Footprint: C0402; Temperature: -55~125℃; Part Status: 试用
C311 = CAP NP_Dup2: CL10C100JB8NNNC,CC0603JRNPO9BN100,CC0603JRNP09BN100; Manufacturer PartNumber: 10pF,5%,C0603,50V,（X7R,X5R,COG,NPO或X7S）; Manufacturer: 广州创龙; Eco-Label: ROHS; ERP Number: 005.0001.0022.00118; Operation Temperature（℃）: -40~+85(Ta); As-Welded: /; PCB Footprint: C0603; Manufacturer Character: -; Temperature: -55~125℃; Part Status: -
C312 C313 = CAP NP_Dup2: CL05C120JB5NNNC,CC0402JRNPO9BN120; Manufacturer: 广州创龙; Manufacturer PartNumber: 12pF,5%,C0402,50V,（X7R,X5R,COG,NPO或X7S）; As-Welded: DNP; Operation Temperature（℃）: -40~+85(Ta); ERP Number: 005.0001.0022.00034; Eco-Label: ROHS; PCB Footprint: C0402; Manufacturer Character: -; Temperature: -55~125℃; Part Status: -
C314 = CAP NP_Dup3: 贴片陶瓷电容,4.7uF,10%,25V,X5R; Manufacturer Character: 中国大陆; Manufacturer PartNumber: 0603X475K250NT; Manufacturer: 广东风华高新科技股份有限公司（FH）; Eco-Label: ROHS; ERP Number: 005.0001.0001.00566; As-Welded: /; Operation Temperature（℃）: -55~+85(Ta); PCB Footprint: C0603; Part Status: 优选
C315 = CAP NP_Dup3: 贴片陶瓷电容,100nF,10%,50V,X7R; Manufacturer Character: 中国大陆; Manufacturer PartNumber: 0402B104K500NT; Manufacturer: 广东风华高新科技股份有限公司（FH）; Eco-Label: ROHS; ERP Number: 005.0001.0001.00681; Operation Temperature（℃）: -55~+125(Ta); As-Welded: /; PCB Footprint: C0402; Part Status: 试用
C316 = CAP NP_Dup2: 贴片陶瓷电容,33pF,5%,50V,COG; Manufacturer: 广东风华高新科技股份有限公司（FH）; Manufacturer PartNumber: 0402CG330J500NT; Manufacturer Character: 中国大陆; Eco-Label: ROHS; ERP Number: 005.0001.0001.00658; Operation Temperature（℃）: -55~+125(Ta); As-Welded: /; PCB Footprint: C0402; Temperature: -55~125℃; Part Status: 试用
C318 = CAP NP_Dup2: 贴片陶瓷电容,22uF,20%,25V,X5R; Manufacturer: 广东风华高新科技股份有限公司（FH）; Manufacturer PartNumber: 0805X226M250NT; Manufacturer Character: 中国大陆; Eco-Label: ROHS; ERP Number: 005.0001.0001.00524; Operation Temperature（℃）: -55~+85(Ta); As-Welded: /; PCB Footprint: C0805; Temperature: -55~125℃; Part Status: 优选
C319 = CAP NP_Dup3: 贴片陶瓷电容,100nF,10%,50V,X7R; Manufacturer: 广东风华高新科技股份有限公司（FH）; Manufacturer PartNumber: 0402B104K500NT; Manufacturer Character: 中国大陆; As-Welded: /; Operation Temperature（℃）: -55~+125(Ta); ERP Number: 005.0001.0001.00681; Eco-Label: ROHS; PCB Footprint: C0402; Part Status: 试用
C320 = CAP NP_Dup3: 贴片陶瓷电容,100pF,5%,50V,COG; Manufacturer PartNumber: 0402CG101J500NT; Manufacturer PN: C1005C0G1H101K050BA; Manufacturer: 广东风华高新科技股份有限公司（FH）; Manufacturer Character: 中国大陆; Tolerance: 10%; Dielectric: C0G; Priority: A; Operation Temperature（℃）: -55~+125(Ta); As-Welded: /; ERP Number: 005.0001.0001.00580; Eco-Label: EXEMPTION; PCB Footprint: C0402; Created by: JJJ; Voltage: 50V; Part Type: C0402; RK PN: C1005C0G1H101K050BA; Part Status: 优选
C321 = CAP NP_Dup2: CL10C100JB8NNNC,CC0603JRNPO9BN100,CC0603JRNP09BN100; Manufacturer PartNumber: 10pF,5%,C0603,50V,（X7R,X5R,COG,NPO或X7S）; Manufacturer: 广州创龙; As-Welded: /; Operation Temperature（℃）: -40~+85(Ta); ERP Number: 005.0001.0022.00118; Eco-Label: ROHS; PCB Footprint: C0603; Manufacturer Character: -; Temperature: -55~125℃; Part Status: -
CON13 = M_2.2 KEY M: （M.2）金手指连接器，KEY M,0.5mm,H=4.2mm; Manufacturer: 深圳市连欣科技有限公司; Manufacturer Character: 中国大陆; Operation Temperature（℃）: /; ERP Number: 005.0001.0003.00544; Eco-Label: ROHS; PCB Footprint: CON_SMD_APCI0113-P001A; Part Status: 优选; As-Welded: /; Manufacturer PartNumber: APCI0107-P001A
D46 = DIODE-TRIG: ESD二极管,VRWM=24V,VBR=300V,一组,双向,8KV,15KV; Manufacturer: 上海雷卯电子科技有限公司（Leiditech）; Manufacturer Character: 中国大陆; As-Welded: /; Eco-Label: ROHS; ERP Number: 005.0001.0017.00056; Operation Temperature（℃）: -40~+90(Tj); PCB Footprint: ESD_0402; Part Status: 优选; Temperature: -55~125℃; Manufacturer PartNumber: PESD2442U005
J14 = IPEX4: IPEX 1代连接器; Manufacturer: 深圳市金航标电子有限公司(kinghelm); Manufacturer Character: 中国大陆; As-Welded: /; Operation Temperature（℃）: -40~85(Ta); PCB Footprint: IPEX1; Manufacturer PartNumber: KH-IPEX-K501-29
L28 = INDUCTOR: 贴片功率电感,2.2uH,0.048Ω,Isat=7.6A,Irms=5A; Manufacturer: 深圳顺络电子股份有限公司（Sunlord）; Manufacturer PartNumber: WPN4020H2R2MT; Manufacturer Character: 中国大陆; Parameter: L2520，奇力新一体成型电感，最大额定电流3A，内阻65毫欧，20%; Eco-Label: ROHS; ERP Number: 005.0001.0006.00163; Operation Temperature（℃）: -40~+125(Ta); As-Welded: /; PCB Footprint: SMD-L4040M-2P; Part Status: 试用; Temperature: -40~125℃
R331 = Resistor_Dup3: 贴片电阻,10K,±1%,1/16W; Manufacturer Character: 中国大陆; Manufacturer PartNumber: RC-02K1002FT; Manufacturer: 广东风华高新科技股份有限公司（FH）; CLASS: DISCRETE; As-Welded: /; room: USB HUB; Operation Temperature（℃）: -55~+125(Ta); ERP Number: 005.0001.0002.01326; Eco-Label: ROHS; PCB Footprint: R0402; Part Status: 优选
R332 = Resistor_Dup3: 0402WGF1242TCE; Manufacturer: 广州创龙; Manufacturer PartNumber: 12.4K,±1%,R0402,≥1/16W; CLASS: DISCRETE; As-Welded: /; Operation Temperature（℃）: -40~+85(Ta); ERP Number: 005.0001.0023.00040; Eco-Label: ROHS; PCB Footprint: R0402; Temperature: -55~155℃; Manufacturer Character: -; Part Status: -
R333 = Resistor_Dup3: 贴片电阻,10K,±1%,1/16W; Manufacturer: 广东风华高新科技股份有限公司（FH）; Manufacturer PartNumber: RC-02K1002FT; Manufacturer Character: 中国大陆; CLASS: DISCRETE; Eco-Label: ROHS; ERP Number: 005.0001.0002.01326; Operation Temperature（℃）: -55~+125(Ta); As-Welded: /; PCB Footprint: R0402; Part Status: 优选; Temperature: –55~155℃
R334 = Resistor_Dup3: RC0402FR-0756KL，0402WGF5602TCE; Manufacturer: 广州创龙; Manufacturer PartNumber: 56K,±1%,R0402,≥1/16W; CLASS: DISCRETE; As-Welded: /; Operation Temperature（℃）: -40~+85(Ta); ERP Number: 005.0001.0023.00207; Eco-Label: ROHS; PCB Footprint: R0402; Temperature: -55~155℃; Manufacturer Character: -; Part Status: -
R335 = Resistor_Dup3: 贴片电阻,10K,±1%,1/16W; Manufacturer: 广东风华高新科技股份有限公司（FH）; Manufacturer Character: 中国大陆; Manufacturer PartNumber: RC-02K1002FT; CLASS: DISCRETE; Eco-Label: ROHS; ERP Number: 005.0001.0002.01326; As-Welded: /; room: USB HUB; Operation Temperature（℃）: -55~+125(Ta); PCB Footprint: R0402; Part Status: 优选
R336 = Resistor_Dup3: 贴片电阻,10K,±1%,1/16W; Manufacturer: 广东风华高新科技股份有限公司（FH）; Manufacturer Character: 中国大陆; Manufacturer PartNumber: RC-02K1002FT; CLASS: DISCRETE; Eco-Label: ROHS; ERP Number: 005.0001.0002.01326; room: USB HUB; Operation Temperature（℃）: -55~+125(Ta); As-Welded: /; PCB Footprint: R0402; Part Status: 优选
R337 = Resistor_Dup3: 贴片电阻,10K,±1%,1/16W; Manufacturer Character: 中国大陆; Manufacturer PartNumber: RC-02K1002FT; Manufacturer: 广东风华高新科技股份有限公司（FH）; CLASS: DISCRETE; Eco-Label: ROHS; ERP Number: 005.0001.0002.01326; Operation Temperature（℃）: -55~+125(Ta); As-Welded: /; PCB Footprint: R0402; Part Status: 优选; Temperature: -55~155℃
R340 = Resistor_Dup3: 贴片电阻,0R,±1%,1/16W; Manufacturer PartNumber: RC-02000FT; Manufacturer: 广东风华高新科技股份有限公司（FH）; Manufacturer Character: 中国大陆; CLASS: DISCRETE; ERP Number: 005.0001.0002.00938; As-Welded: /; Operation Temperature（℃）: -55~+155(Ta); Eco-Label: ROHS; Part Status: 优选; PCB Footprint: R0402
R341 R615 = Resistor_Dup3: 贴片电阻,0R,±1%,1/10W; Manufacturer Character: 中国大陆; Manufacturer PartNumber: RS-03000FT; Manufacturer: 广东风华高新科技股份有限公司（FH）; CLASS: DISCRETE; Eco-Label: ROHS; ERP Number: 005.0001.0002.00956; Operation Temperature（℃）: -55~+155(Ta); room: RS232; As-Welded: /; PCB Footprint: R0603; Part Status: 优选
R342 = Resistor_Dup3: 贴片电阻,0R,±1%,1/10W; Manufacturer: 广东风华高新科技股份有限公司（FH）; Manufacturer PartNumber: RS-03000FT; Manufacturer Character: 中国大陆; CLASS: DISCRETE; As-Welded: /; room: RS232; Operation Temperature（℃）: -55~+155(Ta); ERP Number: 005.0001.0002.00956; Eco-Label: ROHS; PCB Footprint: R0603; Part Status: 优选
R343 = Resistor_Dup3: 贴片电阻,10K,±1%,1/16W; Manufacturer: 广东风华高新科技股份有限公司（FH）; Manufacturer Character: 中国大陆; Manufacturer PartNumber: RC-02K1002FT; CLASS: DISCRETE; Eco-Label: ROHS; ERP Number: 005.0001.0002.01326; As-Welded: /; Operation Temperature（℃）: -55~+125(Ta); PCB Footprint: R0402; Part Status: 优选
TP16 TP17 = TP-S40: /; Manufacturer Character: 中国大陆; Characteristic: Test point,diameter=1.0mm; As-Welded: DNP; PCB Footprint: TP30; Operation Temperature（℃）: /; Manufacturer: /; Manufacturer PartNumber: /
U61 = WD1304E30: DC/DC,Buck,Vin:4.5V~17V,Vout:0.6V~6V,3A,1路; Manufacturer Character: 中国大陆; Manufacturer: 上海芯强微电子股份有限公司（Ecranic）; As-Welded: /; Operation Temperature（℃）: -40~+85(Ta); ERP Number: 005.0001.0004.00889; Eco-Label: ROHS; PCB Footprint: SOT-23-6L; Manufacturer PartNumber: EC2232E; Temperature: -40~85℃; Part Status: 试用
U62 = FCS950U_4: 工业级WIFI & BT 二合一模块选型（USB通信）; Part Description: MODULE WIFI5 BT5 LCC-44 H2.6mm RO; Manufacturer: QUECTEL; Geometry.Height: 2.6mm; ERP Number: 005.0003.0007.00179; Eco-Label: ROHS; As-Welded: /; Operation Temperature（℃）: -45~+85℃; PCB Footprint: FCS950U; Manufacturer Character: -; Manufacturer PartNumber: Ai-M62-CBS; Part Status: 测评